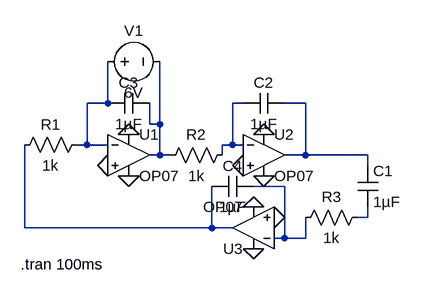
[diagram p0: schematic Draft3.asc]
Draft3.asc, the LTspice schematic file:
Version 4
SHEET 1 880 680
WIRE 80 64 80 0
WIRE 80 64 48 64
WIRE 288 64 272 64
WIRE 384 64 352 64
WIRE 144 96 144 64
WIRE 160 96 160 0
WIRE 160 96 144 96
WIRE 48 128 48 64
WIRE 48 128 32 128
WIRE 80 128 48 128
WIRE 272 128 272 64
WIRE 272 128 256 128
WIRE 288 128 272 128
WIRE 160 144 160 96
WIRE 160 144 144 144
WIRE 176 144 160 144
WIRE 256 144 256 128
WIRE 384 144 384 64
WIRE 384 144 352 144
WIRE 480 144 384 144
WIRE 480 160 480 144
WIRE 352 192 304 192
WIRE 480 240 480 224
WIRE 480 240 464 240
WIRE -48 256 -48 128
WIRE 240 256 240 192
WIRE 240 256 -48 256
WIRE 272 256 240 256
WIRE 352 272 352 192
WIRE 352 272 336 272
WIRE 384 272 384 240
WIRE 384 272 352 272
FLAG 304 288 0
FLAG 304 224 0
FLAG 112 112 0
FLAG 112 176 0
FLAG 320 176 0
FLAG 320 112 0
FLAG 80 160 0
FLAG 288 160 0
FLAG 336 240 0
SYMBOL Opamps\\OP07 112 80 R0
SYMATTR InstName U1
SYMBOL Opamps\\OP07 304 320 R180
SYMATTR InstName U3
SYMBOL cap 464 160 R0
SYMATTR InstName C1
SYMATTR Value 1µF
SYMBOL cap 352 48 R90
WINDOW 0 0 32 VBottom 2
WINDOW 3 32 32 VTop 2
SYMATTR InstName C2
SYMATTR Value 1µF
SYMBOL cap 144 48 R90
WINDOW 0 0 32 VBottom 2
WINDOW 3 32 32 VTop 2
SYMATTR InstName C3
SYMATTR Value 1µF
SYMBOL res 48 112 R90
WINDOW 0 0 56 VBottom 2
WINDOW 3 32 56 VTop 2
SYMATTR InstName R1
SYMATTR Value 1k
SYMBOL res 272 128 R90
WINDOW 0 0 56 VBottom 2
WINDOW 3 32 56 VTop 2
SYMATTR InstName R2
SYMATTR Value 1k
SYMBOL res 480 224 R90
WINDOW 0 0 56 VBottom 2
WINDOW 3 32 56 VTop 2
SYMATTR InstName R3
SYMATTR Value 1k
SYMBOL Opamps\\OP07 320 80 R0
SYMATTR InstName U2
SYMBOL cap 304 176 R90
WINDOW 0 0 32 VBottom 2
WINDOW 3 32 32 VTop 2
SYMATTR InstName C4
SYMATTR Value 1µF
SYMBOL voltage 64 0 R270
WINDOW 0 32 56 VTop 2
WINDOW 3 -32 56 VBottom 2
WINDOW 123 0 0 Left 2
WINDOW 39 0 0 Left 2
SYMATTR InstName V1
SYMATTR Value 6V
TEXT -54 312 Left 2 !.tran 100ms

The netlist it stands for:
* Draft3.asc
XU1 0 N001 0 0 N004 LT1001  ; OP07, pins In+ In- V+ V- OUT
XU3 0 N005 0 0 N007 LT1001  ; OP07, pins In+ In- V+ V- OUT
C1 N003 N006 1µF
C2 N003 N002 1µF
C3 N004 N001 1µF
R1 N001 N007 1k
R2 N002 N004 1k
R3 N006 N005 1k
XU2 0 N002 0 0 N003 LT1001  ; OP07, pins In+ In- V+ V- OUT
C4 N005 N007 1µF
V1 N001 N004 6V
.tran 100ms
.lib LTC.lib
.backanno
.end